# Altium schematic sheet 微波红外报警探测4040-PY1598-V9.0.SCHDOC
size C
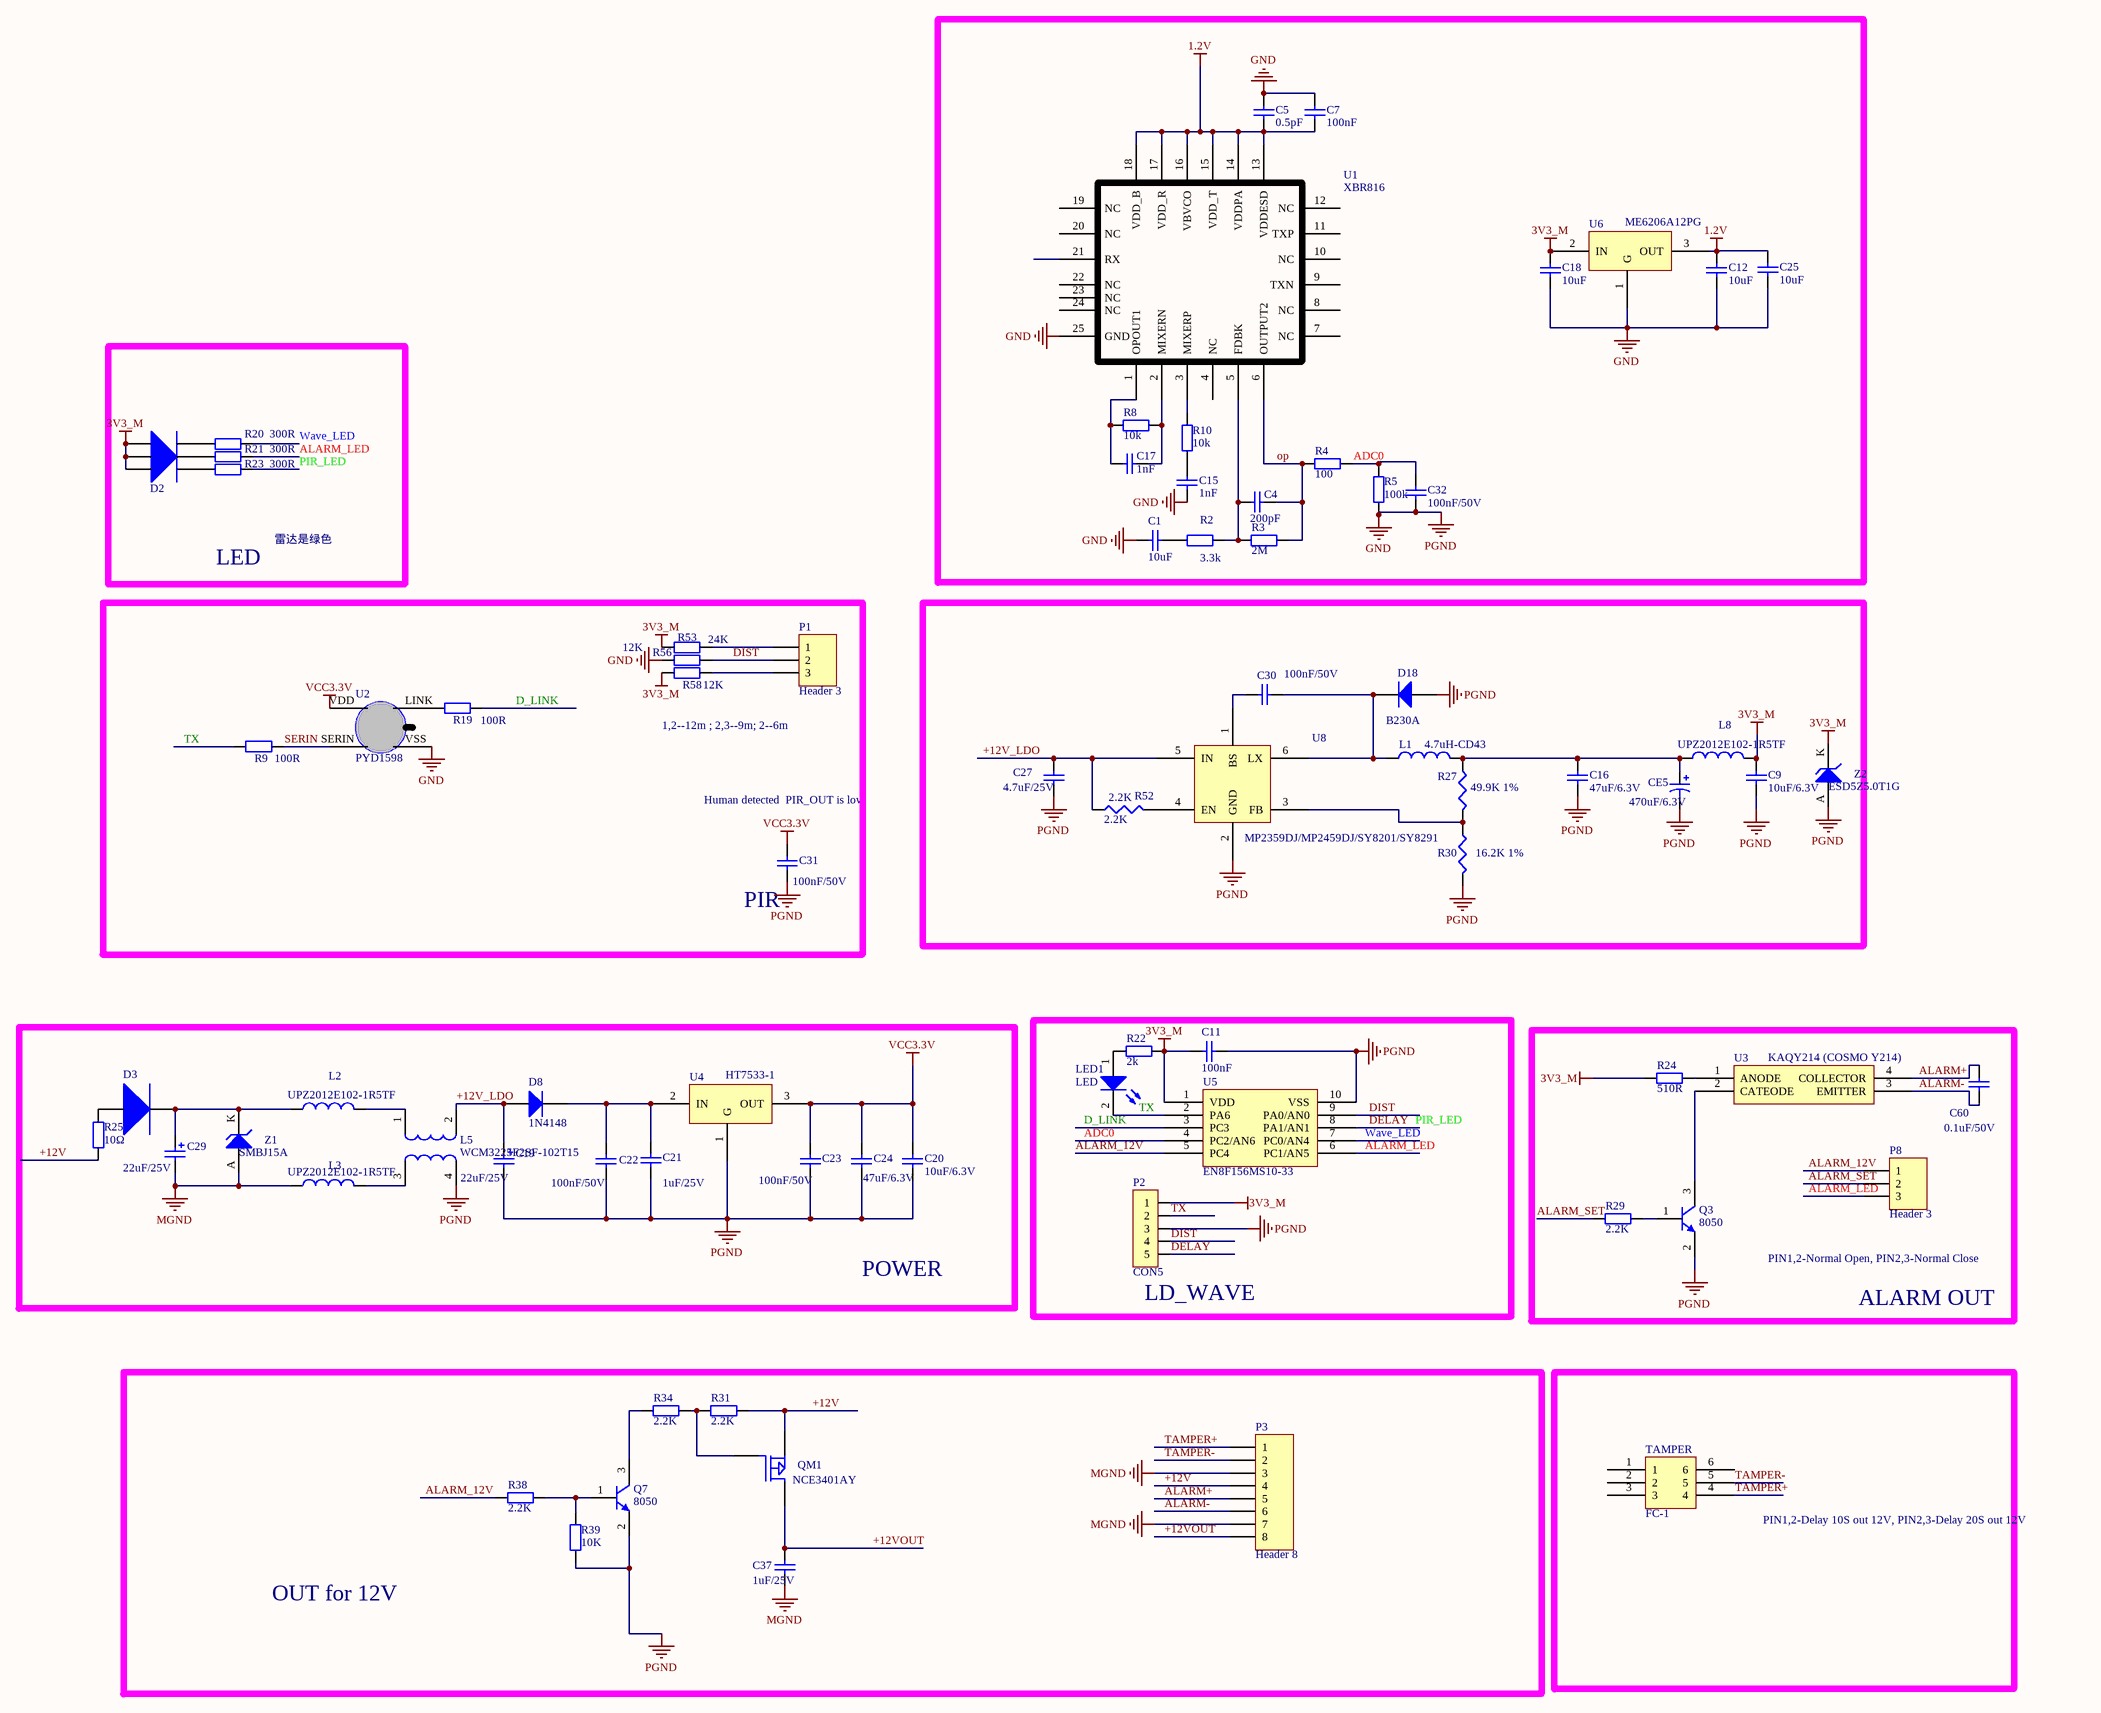
[diagram p0: 微波红外报警探测4040-PY1598-V9.0.SCHDOC]

## Parts
C1  10uF  [C0603]
C4  200pF  [C0603]
C5  0.5pF  [C0603]
C7  100nF  [C0603]
C9  10uF/6.3V  [C0603]
C11  100nF  [C0603]
C12  10uF  [C0603]
C15  1nF  [C0603]
C16  47uF/6.3V  [0805]
C17  1nF  [C0603]
C18  10uF  [C0603]
C19  22uF/25V  [CAP5.0X5.4]
C20  10uF/6.3V  [C0603]
C21  1uF/25V  [C0805]
C22  100nF/50V  [C0603]
C23  100nF/50V  [C0603]
C24  47uF/6.3V  [C0805]
C25  10uF  [C0603]
C27  4.7uF/25V  [0805]
C29  22uF/25V  [CAP5.0X5.4]
C30  100nF/50V  [0603]
C31  100nF/50V  [C0603]
C32  100nF/50V  [0603]
C37  1uF/25V  [C0805]
C60  0.1uF/50V  [C0805]
CE5  470uF/6.3V  [CAP6.3X5.4]
D2  led三色共阴极灯  [三色灯]  (value not drawn)
D3  SS14  [SS14]  (value not drawn)
D8  1N4148  [SOD-80]
D18  B230A  [SMA]
L1  4.7uH-CD43  [CDRH3D16]
L2  UPZ2012E102-1R5TF  [R0805]
L3  UPZ2012E102-1R5TF  [R0805]
L5  WCM3225F2SF-102T15  [CMC-3225]
L8  UPZ2012E102-1R5TF  [R0805]
LED1  LED  [LED-0603]
P1  Header 3  [HDR1X3]
P2  CON5  [PH2.0-5P]
P3  Header 8  [5.08dip-8]
P8  Header 3  [HDR1X3]
Q3  8050  [SOT-23]
Q7  8050  [SOT-23]
QM1  NCE3401AY  [SOT-23]
R2  3.3k  [R0603]
R3  2M  [R0603]
R4  100  [R0603]
R5  100k  [R0603]
R8  10k  [R0603]
R9  100R  [R0603]
R10  10k  [R0603]
R19  100R  [R0603]
R20  value 300R  [R0603]  (hidden comment: Res2)
R21  value 300R  [R0603]  (hidden comment: Res2)
R22  value 2k  [R0603]  (hidden comment: Res2)
R23  value 300R  [R0603]  (hidden comment: Res2)
R24  510R  [R0603]
R25  10Ω  [R0805]
R27  49.9K 1%  [0603]
R29  2.2K  [R0603]
R30  16.2K 1%  [0603]
R31  2.2K  [R0603]
R34  2.2K  [R0603]
R38  2.2K  [R0603]
R39  10K  [R0603]
R52  2.2K  [0603]
R53  24K  [R0603]
R56  12K  [R0603]
R58  12K  [R0603]
TAMPER  FC-1  [TAMPER]
U1  XBR816  [QFN24-1]
U2  PYD1598
U3  value KAQY214 (COSMO Y214)  [TLP627]  (hidden comment: TLP627)
U4  HT7533-1  [SOT-89]
U5  EN8F156MS10-33  [MSOP10-0.5]
U6  ME6206A12PG  [SOT-89]
U8  MP2359DJ/MP2459DJ/SY8201/SY8291  [SOT23-6]
Z1  SMBJ15A  [SMB]
Z2  ESD5Z5.0T1G  [SOD323]

## Blocks framed on the sheet
LED: D2 R20 R21 R23
PIR: C31 P1 R9 R19 R53 R56 R58 U2
POWER: C19-C24 C29 D3 D8 L2 L3 L5 R25 U4 Z1
LD_WAVE: C11 LED1 P2 R22 U5
ALARM OUT: C60 P8 Q3 R24 R29 U3
OUT for 12V: C37 P3 Q7 QM1 R31 R34 R38 R39
PIN1,2-Delay 10S out 12V, PIN2,3-Delay 20S out 12V: TAMPER

## Nets
1.2V: C5.1 C7.1 C12.1 C25.1 U1.13(VDDESD) U1.14(VDDPA) U1.15(VDD_T) U1.16(VBVCO) U1.17(VDD_R) U1.18(VDD_B) U6.3(OUT)
3V3_M: C9.1 C11.2 C18.1 D2.1(A+) D2.2(B+) D2.3(C+) L8.1 P2.1 R22.1 R24.2 R53.2 R58.2 U5.1(VDD) U6.2(IN) Z2.K
GND: C1.2 C5.2 C7.2 C9.2 C11.1 C12.2 C15.1 C16.2 C18.2 C19.2 C20.2 C21.1 C22.1 C23.1 C24.1 C25.2 C27.2 C31.1 C32.2 CE5.2 D18.1(A) L5.4 P2.3 Q3.2(E) Q7.2(E) R5.2 R30.2 R39.1 R56.2 U1.25(GND) U2.VSS U4.1(G) U5.10(VSS) U6.1(G) U8.2(GND) Z2.A  [also labelled PGND]
MGND: C29.2 C37.1 L3.2 P3.3 P3.7 Z1.A
VCC3.3V: C20.1 C23.2 C24.2 C31.2 U2.VDD U4.3(OUT)
+12V: P3.4 QM1.2(S) R25.2 R31.2
+12V_LDO: C19.1 C27.1 D8.1(A) L5.2 R52.1 U8.5(IN)
+12VOUT: C37.2 P3.8 QM1.3(D)
ADC0: C32.1 R4.2 R5.1 U5.4(PC2/AN6)
ALARM+: C60.2 P3.5 U3.4(COLLECTOR)
ALARM-: C60.1 P3.6 U3.3(EMITTER)
ALARM_12V: P8.1 R38.1 U5.5(PC4)
ALARM_LED: P8.3 R21.1 U5.6(PC1/AN5)
ALARM_SET: P8.2 R29.1
D_LINK: R19.1 U5.3(PC3)
DELAY: P2.5 R23.1 U5.8(PA1/AN1)  [also labelled PIR_LED]
DIST: P1.2 P2.4 R56.1 U5.9(PA0/AN0)
op: C4.1 R3.1 R4.1 U1.6(OUTPUT2)
SERIN: R9.1 U2.SERIN
TAMPER+: P3.1 TAMPER.4
TAMPER-: P3.2 TAMPER.5
TX: LED1.2(K) P2.2 R9.2 U5.2(PA6)
Wave_LED: R20.1 U5.7(PC0/AN4)
NetC1_1: C1.1 R2.1
NetC4_2: C4.2 R2.2 R3.2 U1.5(FDBK)
NetC15_2: C15.2 R10.2
NetC16_1: C16.1 CE5.1 L1.2 L8.2 R27.1
NetC17_1: C17.1 R8.1 U1.2(MIXERN)
NetC17_2: C17.2 R8.2 U1.1(OPOUT1)
NetC21_2: C21.2 C22.2 D8.2(K) U4.2(IN)
NetC29_1: C29.1 D3.2(C) L2.2 Z1.K
NetC30_1: C30.1 D18.2(K) L1.1 U8.6(LX)
NetC30_2: C30.2 U8.1(BS)
NetD2_4: D2.4(A-) R20.2
NetD2_5: D2.5(B-) R21.2
NetD2_6: D2.6(C-) R23.2
NetD3_1: D3.1(B) R25.1
NetL2_1: L2.1 L5.1
NetL3_1: L3.1 L5.3
NetLED1_1: LED1.1(A) R22.2
NetP1_1: P1.1 R53.1
NetP1_3: P1.3 R58.1
NetQ3_1: Q3.1(B) R29.2
NetQ3_3: Q3.3(C) U3.2(CATEODE)
NetQ7_1: Q7.1(B) R38.2 R39.2
NetQ7_3: Q7.3(C) R34.1
NetQM1_1: QM1.1(G) R31.1 R34.2
NetR10_1: R10.1 U1.3(MIXERP)
NetR19_2: R19.2 U2.LINK
NetR24_1: R24.1 U3.1(ANODE)
NetR27_2: R27.2 R30.1 U8.3(FB)
NetR52_2: R52.2 U8.4(EN)

Not connected (* = marked no-connect by the designer): TAMPER 1 2 3 6; U1 4(NC) 7(NC) 8(NC) 9(TXN) 10(NC) 11(TXP) 12(NC) 19(NC) 20(NC) 21(RX) 22(NC) 23(NC) 24(NC)

## Notes on the sheet
- 雷达是绿色
- 1,2--12m ; 2,3--9m; 2--6m
- (near C31) Human detected  PIR_OUT is low
- PIN1,2-Normal Open, PIN2,3-Normal Close

## Library data of the parts
C1 C4 C5 C7 C9 C11 C12 C15 C17 C18 C20-C25 C31 C37 C60 = Cap: Capacitor; Published: 8-Jun-2000; LatestRevisionDate: 17-Jul-2002; LatestRevisionNote: Re-released for DXP Platform.; PackageReference: RAD-0.3; Publisher: Altium Limited; PackageDescription: Radial Cap, Thru-Hole; 2 Leads; 0.3 in Pin Spacing
  C1 C12 C18 C25: Value: 10uF
  C4: Value: 200pF
  C5: Value: 0.5pF
  C7 C11: Value: 100nF
  C9 C20: Value: 10uF/6.3V
  C15 C17: Value: 1nF
  C21 C37: Value: 1uF/25V
  C22 C23 C31: Value: 100nF/50V
  C24: Value: 47uF/6.3V
  C60: Value: 0.1uF/50V
C16 C27 C30 C32 = Cap Semi: Capacitor (Semiconductor SIM Model); Published: 8-Jun-2000; LatestRevisionDate: 29-May-2009; LatestRevisionNote: IPC-7351 Footprint Added.; PackageReference: C1206; Publisher: Altium Limited; PackageDescription: Chip Capacitor
  C16: Value: 47uF/6.3V
  C27: Value: 4.7uF/25V
  C30 C32: Value: 100nF/50V
C19 C29 = Cap Pol2: Polarized Capacitor (Axial); Published: 8-Jun-2000; LatestRevisionDate: 17-Jul-2002; LatestRevisionNote: Re-released for DXP Platform.; PackageReference: POLAR0.8; Publisher: Altium Limited; PackageDescription: Polarized Capacitor; 2 Leads; Value: 22uF/25V
CE5 = Cap Pol1: Polarized Capacitor (Radial); Published: 8-Jun-2000; LatestRevisionDate: 17-Jul-2002; LatestRevisionNote: Re-released for DXP Platform.; PackageReference: RB7.6-15; Publisher: Altium Limited; Value: 470uF/6.3V
D8 = Diode 1N4005: 1 Amp General Purpose Rectifier; Published: 8-Jun-2000; LatestRevisionDate: 17-Jul-2002; LatestRevisionNote: Re-released for DXP Platform.; DatasheetDocument: 1998; PackageDocument: Aug-1999; PackageReference: DO-41; Publisher: Altium Limited; Code_JEDEC: DO-204-AL; ComponentLink1Description: Manufacturer Link; ComponentLink1URL: http://www.fairchildsemi.com/; ComponentLink2Description: Datasheet; ComponentLink2URL: http://www.fairchildsemi.com/ds/1N%2F1N4001.pdf
D18 = Diode 1N4007: 1 Amp General Purpose Rectifier; Revision 1: 11-Jul-2000: SIM Model Added.; Revision 2: 17-Jul-2002: Re-released for DXP Platform.; Package Information: Latest Revision: Aug-1999; Code - JEDEC: DO-204-AL; Published: 8-Jun-2000; Datasheet: Latest Revision: 1998; Package Reference: DO-41; Publisher: Altium Limited; Value: B230A
L1-L3 L8 = Inductor: Code_IEC: 1005; Published: 8-Jun-2000; PackageReference: 0402-A; Publisher: Altium Limited; Code_JEITA: 0402
  L1: LatestRevisionDate: 17-Jul-2002; LatestRevisionNote: Re-released for DXP Platform.; Value: 4.7uH-CD43
  L2 L3 L8: LatestRevisionDate: 29-May-2009; LatestRevisionNote: IPC-7351 Footprint Added.; PackageDescription: Chip Inductor; Value: UPZ2012E102-1R5TF
L5 = Trans: Transformer; Published: 24-Mar-1999; LatestRevisionDate: 08-Jul-2005; LatestRevisionNote: Mech Layer 1 removed.; PackageReference: TRANS; Publisher: Altium Limited; PackageDescription: Transformer; 4 Leads; Value: WCM3225F2SF-102T15
LED1 = LED0: Published: 8-Jun-2000; LatestRevisionDate: 08-Jul-2005; LatestRevisionNote: Mech Layer 1 removed.; PackageReference: LED-0; Publisher: Altium Limited; PackageDescription: LED; 2 Leads; Value: LED
P1 P8 = Header 3: Header, 3-Pin; LatestRevisionDate: 17-Jul-2002; LatestRevisionNote: Re-released for DXP Platform.; Publisher: Altium Limited
P2 = CON5: Connector
P3 = Header 8: Header, 8-Pin; LatestRevisionDate: 17-Jul-2002; LatestRevisionNote: Re-released for DXP Platform.; Publisher: Altium Limited
Q3 Q7 = 2N3904: NPN General Purpose Amplifier; Published: 8-Jun-2000; LatestRevisionDate: 15-Jan-2003; LatestRevisionNote: PCB Footprint 'BCY-W3/D4.7' replaced; DatasheetVersion: 1997; PackageVersion: Sep-1998; PackageReference: TO-92A; Publisher: Altium Limited; PackageDescription: TO, Flat Index; 3 In-Line, Axial Leads; Body Dia. 4.5mm; Leads 0.51 x 0.48 mm (max); ComponentLink1Description: Manufacturer Link; ComponentLink1URL: http://www.fairchildsemi.com/; ComponentLink2Description: Datasheet; ComponentLink2URL: http://www.fairchildsemi.com/ds/2N%2F2N3904.pdf; Value: 8050
QM1 = MOSFET P: Value: NCE3401AY
R2-R5 R8-R10 R19-R25 R29 R31 R34 R38 R39 R53 R56 R58 = Res2: Resistor; Published: 8-Jun-2000; LatestRevisionDate: 17-Jul-2002; LatestRevisionNote: Re-released for DXP Platform.; PackageReference: AXIAL-0.4; Publisher: Altium Limited
  R2: PackageDescription: Axial Device, Thru-Hole; 2 Leads; 0.4 in Pin Spacing; Value: 3.3k
  R3: PackageDescription: Axial Device, Thru-Hole; 2 Leads; 0.4 in Pin Spacing; Value: 2M
  R4: PackageDescription: Axial Device, Thru-Hole; 2 Leads; 0.4 in Pin Spacing; Value: 100
  R5: PackageDescription: Axial Device, Thru-Hole; 2 Leads; 0.4 in Pin Spacing; Value: 100k
  R8 R10: PackageDescription: Axial Device, Thru-Hole; 2 Leads; 0.4 in Pin Spacing; Value: 10k
  R9 R19: Value: 100R
  R20-R23: PackageDescription: Axial Device, Thru-Hole; 2 Leads; 0.4 in Pin Spacing
  R24: PackageDescription: Axial Device, Thru-Hole; 2 Leads; 0.4 in Pin Spacing; Value: 510R
  R25: PackageDescription: Axial Device, Thru-Hole; 2 Leads; 0.4 in Pin Spacing; Value: 10Ω
  R29 R31 R34 R38: PackageDescription: Axial Device, Thru-Hole; 2 Leads; 0.4 in Pin Spacing; Value: 2.2K
  R39: PackageDescription: Axial Device, Thru-Hole; 2 Leads; 0.4 in Pin Spacing; Value: 10K
  R53: Value: 24K
  R56 R58: Value: 12K
R27 R30 R52 = Res3: Resistor; Published: 8-Jun-2000; Revision: July-2002: Re-released for DXP Platform.; Publisher: Altium Limited
  R27: Value: 49.9K 1%
  R30: Value: 16.2K 1%
  R52: Value: 2.2K
U1 = XBR1000_24_1
U4 U6 = 12S33
  U4: Value: HT7533-1
  U6: Value: ME6206A12PG
U8 = SY8120B: Value: MP2359DJ/MP2459DJ/SY8201/SY8291
Z1 Z2 = D Zener: Zener Diode; Published: 8-Jun-2000; LatestRevisionDate: 17-Jul-2002; LatestRevisionNote: Re-released for DXP Platform.; PackageReference: DIODE-0.7; Publisher: Altium Limited; PackageDescription: Diode, Thru-Hole; 2 Leads; 0.7 in Pin Spacing
D3 = SS14: Value: SS14